# EAGLE design 011_02 (EAGLE 4.11)
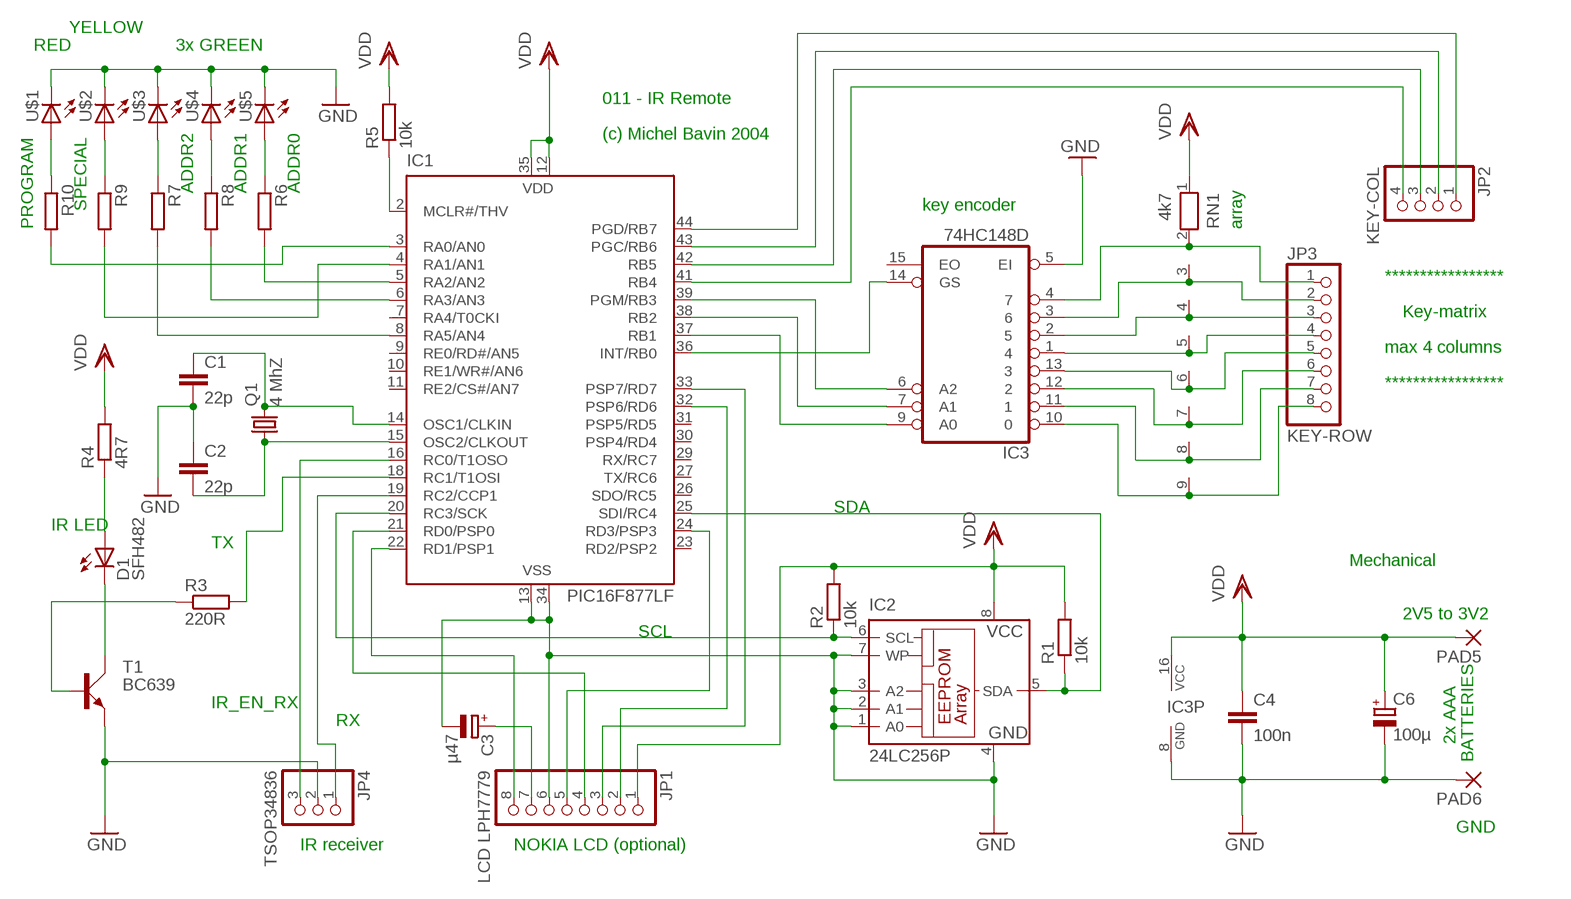
[diagram p0: schematic, sheet 1]

## Parts
C1  22p  C-EU025-024X044  [C025-024X044]
C2  22p  C-EU025-024X044  [C025-024X044]
C3  µ47  CPOL-EUE2.5-5  [E2,5-5]
C4  100n  C-EU025-024X044  [C025-024X044]
C6  100µ  CPOL-EUE2-5  [E2-5]
D1  SFH482  [SFH482]
IC1  PIC16F877LF  [S44]
IC2  24LC256P  [DIL8]
IC3  74HC148D  [SO16]
JP1  LCD LPH7779  PINHD-1X8  [1X08]
JP2  KEY-COL  PINHD-1X4  [1X04]
JP3  KEY-ROW  PINHD-1X8  [1X08]
JP4  TSOP34836  PINHD-1X3  [1X03]
PAD5  1,6/0,8  [1,6/0,8]
PAD6  1,6/0,8  [1,6/0,8]
Q1  4 MhZ  CRYTALHC49S  [HC49/S]
R1  10k  R-EU_0309/V  [0309V]
R2  10k  R-EU_0309/V  [0309V]
R3  220R  R-EU_0309/V  [0309V]
R4  4R7  R-EU_0309/V  [0309V]
R5  10k  R-EU_0309/V  [0309V]
R6  R-EU_0309/V  [0309V]
R7  R-EU_0309/V  [0309V]
R8  R-EU_0309/V  [0309V]
R9  R-EU_0309/V  [0309V]
R10  R-EU_0309/V  [0309V]
RN1  4k7  RN08  [RN-9]
T1  BC639  [SOT54D]
U$1  LED3MM  [LED3MM]
U$2  LED3MM  [LED3MM]
U$3  LED3MM  [LED3MM]
U$4  LED3MM  [LED3MM]
U$5  LED3MM  [LED3MM]

## Nets
GND: C1.2 C2.1 C3.- C4.2 C6.- IC1.13(VSS) IC1.34(VSS) IC2.1(A0) IC2.2(A1) IC2.3(A2) IC2.4(GND) IC2.7(WP) IC3.5(EI) IC3.8(GND) JP1.6 JP4.2 PAD6.1(P) T1.E U$1.K(C) U$2.K(C) U$3.K(C) U$4.K(C) U$5.K(C)
N$1: IC1.36(INT/RB0) IC3.14(GS)
N$2: IC1.39(PGM/RB3) IC3.6(A2)
N$3: IC1.38(RB2) IC3.7(A1)
N$4: IC1.37(RB1) IC3.9(A0)
N$5: IC3.4 JP3.1 RN1.2
N$6: IC3.2 JP3.3 RN1.4
N$7: IC3.12 JP3.6 RN1.7
N$8: IC3.3 JP3.2 RN1.3
N$9: IC3.13 JP3.5 RN1.6
N$10: IC1.20(RC3/SCK) IC2.6(SCL) R2.1
N$11: IC3.11 JP3.7 RN1.8
N$12: IC3.10 JP3.8 RN1.9
N$13: C2.2 IC1.15(OSC2/CLKOUT) Q1.1
N$14: C1.1 IC1.14(OSC1/CLKIN) Q1.2
N$15: IC3.1 JP3.4 RN1.5
N$16: IC1.25(SDI/RC4) IC2.5(SDA) R1.1
N$17: IC1.2(MCLR#/THV) R5.1
N$18: IC1.41(RB4) JP2.4
N$19: IC1.42(RB5) JP2.3
N$20: IC1.43(PGC/RB6) JP2.2
N$21: IC1.44(PGD/RB7) JP2.1
N$22: IC1.18(RC1/T1OSI) R3.2
N$23: R3.1 T1.B
N$24: D1.K(C) T1.C
N$25: D1.A R4.1
N$26: IC1.16(RC0/T1OSO) JP4.3
N$27: IC1.19(RC2/CCP1) JP4.1
N$28: IC1.21(RD0/PSP0) JP1.4
N$29: IC1.22(RD1/PSP1) JP1.8
N$30: IC1.24(RD3/PSP3) JP1.5
N$31: IC1.32(PSP6/RD6) JP1.2
N$32: IC1.33(PSP7/RD7) JP1.3
N$33: C3.+ JP1.7
N$34: IC1.8(RA5/AN4) R7.2
N$35: IC1.6(RA3/AN3) R8.2
N$36: IC1.5(RA2/AN2) R6.2
N$37: IC1.4(RA1/AN1) R9.2
N$38: IC1.3(RA0/AN0) R10.2
N$39: R10.1 U$1.A
N$40: R9.1 U$2.A
N$41: R7.1 U$3.A
N$42: R8.1 U$4.A
N$43: R6.1 U$5.A
VDD: C4.1 C6.+ IC1.12(VDD) IC1.35(VDD) IC2.8(VCC) IC3.16(VCC) JP1.1 PAD5.1(P) R1.2 R2.2 R4.2 R5.2 RN1.1
Unconnected: IC1.7(RA4/T0CKI) IC1.9(RE0/RD#/AN5) IC1.10(RE1/WR#/AN6) IC1.11(RE2/CS#/AN7) IC1.23(RD2/PSP2) IC1.26(SDO/RC5) IC1.27(TX/RC6) IC1.29(RX/RC7) IC1.30(PSP4/RD4) IC1.31(PSP5/RD5) IC3.15(EO)

## Notes on the sheet
- YELLOW
- RED | 3x GREEN
- 011 - IR Remote
- (c) Michel Bavin 2004
- ADDR2 | ADDR1 | ADDR0
- SPECIAL | key encoder
- PROGRAM | array
- *****************
- Key-matrix
- max 4 columns
- *****************
- SDA
- IR LED
- TX
- Mechanical
- 2V5 to 3V2
- SCL
- IR_EN_RX
- RX
- 2x AAA
- BATTERIES
- GND
- IR receiver | NOKIA LCD (optional)

## Library data of the parts
C1 C2 C4 = rcl:C-EU: CAPACITOR, European symbol
C3 C6 = rcl:CPOL-EU: POLARIZED CAPACITOR, European symbol
D1 = led:SFH482: IR LED infrared emitting diode, Infineon
IC1 = plcc-socket:PIC16F87*: MICROCONTROLLER
IC2 = microchip:24*: Serial EEPROM I2C
IC3 = 74xx-eu:74*148: 10-line to 4-line and 8-line to 3-line PRIORITY ENCODER
JP1 JP3 = pinhead:PINHD-1X8: PIN HEADER
JP2 = pinhead:PINHD-1X4: PIN HEADER
JP4 = pinhead:PINHD-1X3: PIN HEADER
PAD5 PAD6 = wirepad:1,6/0,8: THROUGH-HOLE PAD
Q1 = crystal:CRYTAL: CRYSTAL
R1-R10 = rcl:R-EU_: RESISTOR, European symbol
RN1 = resistor-net:RN08: RESISTOR NETWORK
T1 = transistor-small-signal:BC639: NPN TRANSISTOR
U$1-U$5 = led:LED: LED OSRAM: - CHIPLED LG R971, LG N971, LY N971, LG Q971, LY Q971, LO R971, LY R971 LH N974, LH R974 LS Q976, LO Q976, LY Q976 LO Q996 - Hyper CHIPLED LW Q18S LB Q993, LB Q99A, LB R99A - SideLED LS A670, LO A670, LY A670, LG A670, LP A670 LB A673, LV A673, LT A673, LW A673 LH A674 LY A675 LS A676, LA A676, LO A676, LY A676, LW A676 LS A679, LY A679, LG A679 - Hyper Micro SIDELED® LS Y876, LA Y876, LO Y876, LY Y876 LT Y87S - SmartLED LW L88C, LW L88S LB L89C, LB L89S, LG L890 LS L89K, LO L89K, LY L89K LS L896, LA L896, LO L896, LY L896 - TOPLED LS T670, LO T670, LY T670, LG T670, LP T670 LSG T670, LSP T670, LSY T670, LOP T670, LYG T670 LG T671, LOG T671, LSG T671 LB T673, LV T673, LT T673, LW T673 LH T674 LS T676, LA T676, LO T676, LY T676, LB T676, LH T676, LSB T676, LW T676 LB T67C, LV T67C, LT T67C, LS T67K, LO T67K, LY T67K, LW E67C LS E67B, LA E67B, LO E67B, LY E67B, LB E67C, LV E67C, LT E67C LW T67C LS T679, LY T679, LG T679 LS T770, LO T770, LY T770, LG T770, LP T770 LB T773, LV T773, LT T773, LW T773 LH T774 LS E675, LA E675, LY E675, LS T675 LS T776, LA T776, LO T776, LY T776, LB T776 LHGB T686 LT T68C, LB T68C - Hyper Mini TOPLED® LB M676 - Mini TOPLED Santana® LG M470 LS M47K, LO M47K, LY M47K Source: http://www.osram.convergy.de/

## Board
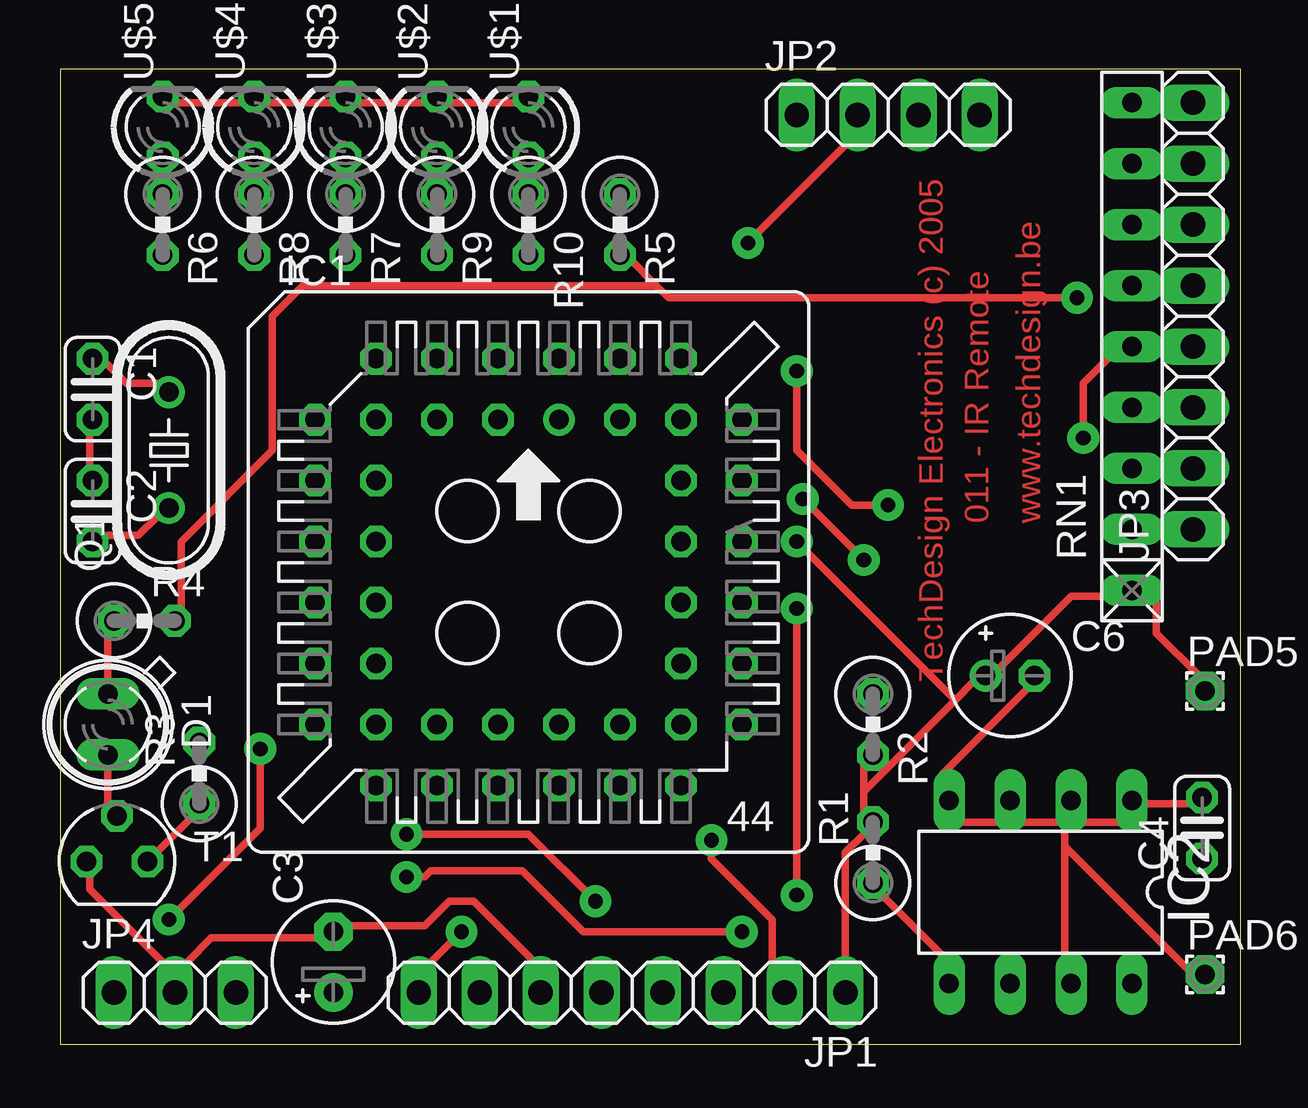
[diagram p1: board, top side]
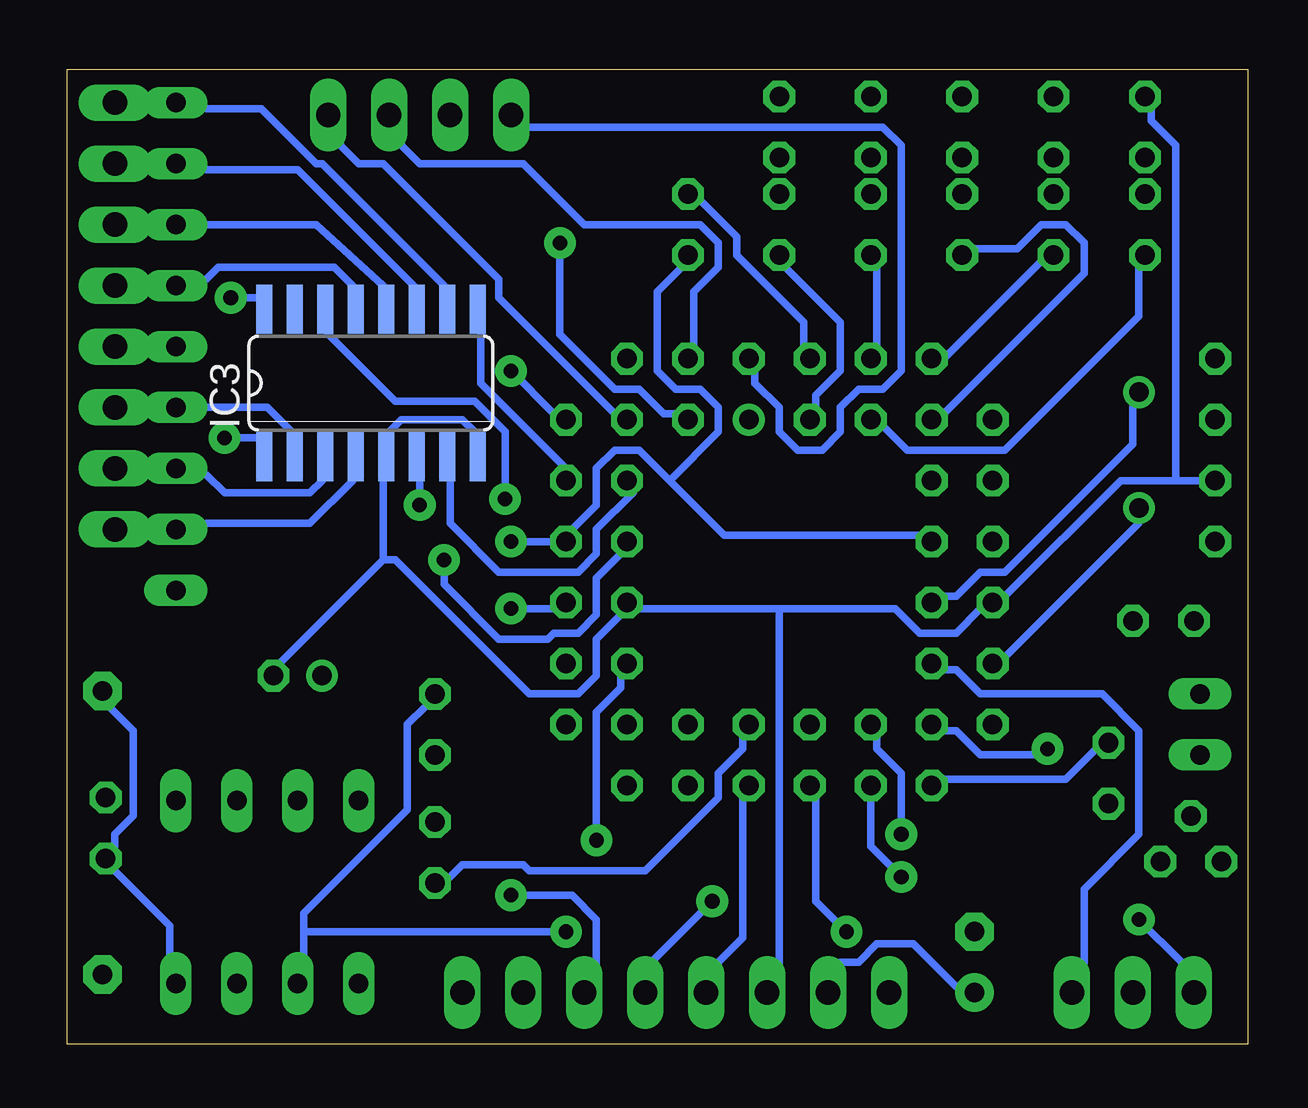
[diagram p2: board, bottom side, seen from below]

Size 49.2 x 40.63 mm. Coordinates in mm from the lower left corner, seen from the top.
Outline: 0,0 49.2,0 49.2,40.63 0,40.63 0,0
Copper layers (1*16): Top 0.035mm / dielectric 1.5mm / Bottom 0.035mm
Design rules "michel4": minimum track width 12mil, minimum drill 24mil, track to track 12mil, track to pad 12mil, pad to pad 12mil, via to via 12mil, smd to smd 10mil, copper to edge 40mil, drill to drill 8mil, minimum pad ring 10mil, minimum via ring 14mil, stop-mask expansion 4mil, vias tented up to drill 0mil, thermal gap 10mil
tRestrict: area 9.1,9.5 to 29.9,30.1; area 31.5,24.3 to 41.9,30.3

### Footprints (pad centres in the part's own frame; a part is rotated, then mirrored left to right if it is on the bottom)
C025-024X044 = drill 0.813 octagon: 1 -1.27,0; 2 1.27,0
E2,5-5 = drill 0.813 pad 1.6 round: + -1.27,0 | drill 0.813 pad 1.6 octagon: - 1.27,0
E2-5 = drill 0.813 pad 1.27 round: + -1.016,0 | drill 0.813 pad 1.27 octagon: - 1.016,0
SFH482 = drill 0.813 long: A -1.27,0; K 1.27,0
S44 = drill 0.813 round: 1 1.27,6.35 | drill 0.813 octagon: 2 -1.27,8.89; 3 -1.27,6.35; 4 -3.81,8.89; 5 -3.81,6.35; 6 -6.35,8.89; 7 -8.89,6.35; 8 -6.35,6.35; 9 -8.89,3.81; 10 -6.35,3.81; 11 -8.89,1.27; 12 -6.35,1.27; 13 -8.89,-1.27; 14 -6.35,-1.27; 15 -8.89,-3.81; 16 -6.35,-3.81; 17 -8.89,-6.35; 18 -6.35,-8.89; 19 -6.35,-6.35; 20 -3.81,-8.89; 21 -3.81,-6.35; 22 -1.27,-8.89; 23 -1.27,-6.35; 24 1.27,-8.89; 25 1.27,-6.35; 26 3.81,-8.89; 27 3.81,-6.35; 28 6.35,-8.89; 29 8.89,-6.35; 30 6.35,-6.35; 31 8.89,-3.81; 32 6.35,-3.81; 33 8.89,-1.27; 34 6.35,-1.27; 35 8.89,1.27; 36 6.35,1.27; 37 8.89,3.81; 38 6.35,3.81; 39 8.89,6.35; 40 6.35,8.89; 41 6.35,6.35; 42 3.81,8.89; 43 3.81,6.35; 44 1.27,8.89
DIL8 = drill 0.813 long: 1 -3.81,-3.81; 2 -1.27,-3.81; 3 1.27,-3.81; 4 3.81,-3.81; 5 3.81,3.81; 6 1.27,3.81; 7 -1.27,3.81; 8 -3.81,3.81
SO16 = smd 0.66 x 2.032: 1 -4.445,-3.073; 2 -3.175,-3.073; 3 -1.905,-3.073; 4 -0.635,-3.073; 5 0.635,-3.073; 6 1.905,-3.073; 7 3.175,-3.073; 8 4.445,-3.073; 9 4.445,3.073; 10 3.175,3.073; 11 1.905,3.073; 12 0.635,3.073; 13 -0.635,3.073; 14 -1.905,3.073; 15 -3.175,3.073; 16 -4.445,3.073
1X08 = drill 1.016 long: 1 -8.89,0; 2 -6.35,0; 3 -3.81,0; 4 -1.27,0; 5 1.27,0; 6 3.81,0; 7 6.35,0; 8 8.89,0
1X04 = drill 1.016 long: 1 -3.81,0; 2 -1.27,0; 3 1.27,0; 4 3.81,0
1X03 = drill 1.016 long: 1 -2.54,0; 2 0,0; 3 2.54,0
1,6/0,8 = drill 0.813 pad 1.6 octagon: 1 0,0
HC49/S = drill 0.813 round: 1 -2.413,0; 2 2.413,0
0309V = drill 0.813 octagon: 1 -1.27,0; 2 1.27,0
RN-9 = drill 0.813 long: 1 -10.16,0; 2 -7.62,0; 3 -5.08,0; 4 -2.54,0; 5 0,0; 6 2.54,0; 7 5.08,0; 8 7.62,0; 9 10.16,0
SOT54D = drill 0.813 octagon: B 1.27,0; C 0,1.905; E -1.27,0
LED3MM = drill 0.813 octagon: A -1.27,0; K 1.27,0

### Placement (x,y rotation side)
C1  1.36,27.3 270 top
C2  1.36,22.22 270 top
C3  11.39,3.42 90 top
C4  47.59,9.01 90 top
C6  39.59,15.36 0 top
D1  1.99,13.33 270 top
IC1  19.52,19.68 0 top
IC2  40.86,6.34 180 top
IC3  36.54,27.55 0 bottom
JP1  23.84,2.15 180 top
JP2  34.51,38.73 0 top
JP3  47.21,30.35 90 top
JP4  4.79,2.15 0 top
PAD5  47.71,14.73 0 top
PAD6  47.71,2.92 0 top
Q1  4.53,24.76 90 top
R1  33.87,8 90 top
R2  33.87,13.33 270 top
R3  5.8,11.3 90 top
R4  3.52,17.65 0 top
R5  23.33,34.16 270 top
R6  4.28,34.16 270 top
R7  11.9,34.16 270 top
R8  8.09,34.16 270 top
R9  15.71,34.16 270 top
R10  19.52,34.16 270 top
RN1  44.67,29.08 90 top
T1  2.38,7.61 0 top
U$1  19.52,38.22 90 top
U$2  15.71,38.22 90 top
U$3  11.9,38.22 90 top
U$4  8.09,38.22 90 top
U$5  4.28,38.22 90 top

### Tracks (layer width: path | path; a pad name or v marks a point on that pad's centre or on a via)
GND
  Top 0.305: 41.87,8.25 41.87,9.01 IC2.2 | 41.87,8.25 41.87,3.68 IC2.7 | IC2.2 42.63,9.27 44.16,9.27 IC2.1 45.17,10.03 46.95,10.03 C4.2 | 41.87,8.25 46.95,3.17 PAD6.1 | C6.- 40.35,14.85 36.79,11.3 IC2.4 37.55,9.27 39.08,9.27 IC2.3 40.09,9.27 41.62,9.27 IC2.2 | T1.E 1.23,6.98 1.23,6.47 4.28,3.42 JP4.2 5.3,3.42 6.31,4.44 10.63,4.44 C3.- 12.15,4.95 15.2,4.95 16.22,5.96 17.23,5.96 19.77,3.42 JP1.6 | U$5.K 4.79,39.24 7.58,39.24 U$4.K 8.6,39.24 11.39,39.24 U$3.K 12.41,39.24 15.2,39.24 U$2.K 16.22,39.24 19.01,39.24 U$1.K | C2.1 1.23,24 1.23,25.52 C1.2
  Bottom 0.305: IC3.8 32.22,25.27 32.22,25.52 32.73,26.03 35.27,26.03 36.03,25.27 IC3.5 36.03,23.49 36.03,20.19 | 36.03,20.19 40.35,15.87 C6.- | 3.01,23.49 5.3,23.49 10.12,18.66 IC1.13 11.14,18.16 12.15,17.14 13.68,17.14 14.69,18.16 19.52,18.16 | 3.01,23.49 C2.1 | 19.52,18.16 25.36,18.16 IC1.34 26.12,17.9 27.14,16.89 27.14,15.36 27.9,14.6 29.93,14.6 35.52,20.19 36.03,20.19 | 19.52,18.16 19.52,3.42 JP1.6 | 3.01,23.49 3.01,37.46 4.03,38.48 4.03,38.98 U$5.K
N$1  (via drill 0.61)
  Top 0.305: v33.49,20.19 v30.95,22.73
  Bottom 0.305: v30.95,22.73 30.95,25.52 32.22,26.79 35.52,26.79 38.32,29.59 38.32,29.84 IC3.14 | v33.49,20.19 33.49,19.17 31.2,16.89 29.17,16.89 28.92,17.14 27.9,17.14 27.14,17.9 27.14,19.43 26.12,20.44 IC1.36
N$2  (via drill 0.61)
  Top 0.305: v34.51,22.47 32.98,22.47 30.7,24.76 v30.7,28.06
  Bottom 0.305: v34.51,22.47 34.51,23.49 IC3.6 | v30.7,28.06 28.92,26.28 IC1.39
N$3
  Bottom 0.305: IC3.7 33.24,23.49 33.24,21.71 31.2,19.68 27.9,19.68 27.14,20.44 27.14,21.46 25.62,22.98 IC1.38
N$4
  Bottom 0.305: IC3.9 31.97,29.84 31.97,27.55 28.41,24 IC1.37
N$5
  Top 0.305: JP3.1 45.94,21.2 RN1.2
  Bottom 0.305: IC3.4 37.3,23.49 39.08,21.71 43.4,21.71 RN1.2
N$6
  Top 0.305: JP3.3 45.94,26.28 RN1.4
  Bottom 0.305: IC3.2 39.84,25.27 39.84,25.52 40.86,26.54 RN1.4
N$7
  Top 0.305: JP3.6 45.94,33.9 RN1.7
  Bottom 0.305: IC3.12 36.03,31.62 38.82,34.16 RN1.7
N$8
  Top 0.305: JP3.2 45.94,23.74 RN1.3
  Bottom 0.305: IC3.3 38.57,23.49 39.08,22.98 42.63,22.98 43.4,23.74 RN1.3
N$9
  Top 0.305: JP3.5 45.94,31.36 RN1.6
  Bottom 0.305: IC3.13 37.3,31.62 38.06,32.38 42.89,32.38 43.4,31.87 RN1.6
N$10  (via drill 0.61)
  Top 0.305: v14.44,6.98 15.2,6.98 15.46,7.23 19.27,7.23 21.81,4.69 v28.41,4.69
  Bottom 0.305: 39.33,4.69 39.33,5.46 35.01,9.77 35.01,13.33 34.25,14.09 R2.1 | 39.33,4.69 39.33,3.68 IC2.6 | v14.44,6.98 15.71,8.25 IC1.20 | v28.41,4.69 39.33,4.69
N$11
  Top 0.305: JP3.7 45.94,36.44 RN1.8
  Bottom 0.305: IC3.11 34.76,31.62 39.59,36.44 43.4,36.44 RN1.8
N$12
  Top 0.305: JP3.8 45.94,38.98 RN1.9
  Bottom 0.305: IC3.10 33.49,31.62 38.57,36.7 38.82,36.7 41.11,38.98 43.4,38.98 RN1.9
N$13
  Top 0.305: C2.2 1.99,21.2 3.26,21.2 4.03,21.97 Q1.1
  Bottom 0.305: IC1.15 10.12,16.12 4.53,21.71 Q1.1
N$14
  Top 0.305: Q1.2 4.03,27.55 2.76,27.55 1.99,28.32 C1.1
  Bottom 0.305: IC1.14 12.66,18.66 12.15,18.66 11.14,19.68 10.12,19.68 4.79,25.01 4.79,26.54 Q1.2
N$15  (via drill 0.61)
  Top 0.305: v42.63,25.27 42.63,27.55 43.65,28.57 RN1.5 45.94,28.82 JP3.4
  Bottom 0.305: v42.63,25.27 41.11,25.27 IC3.1
N$16
  Top 0.305: R1.1 34.25,6.22 36.79,3.68 IC2.5
  Bottom 0.305: IC1.25 21.04,12.82 21.04,12.31 22.06,11.3 22.06,10.28 25.11,7.23 29.93,7.23 30.19,7.49 32.73,7.49 33.24,6.98 R1.1
N$17
  Bottom 0.305: IC1.2 18.5,29.08 18.5,30.09 21.3,32.89 21.3,33.65 22.82,35.17 R5.1
N$18
  Bottom 0.305: IC1.41 26.38,26.28 31.2,31.11 31.2,31.87 36.03,36.7 37.05,36.7 37.81,37.46 JP2.4
N$19
  Bottom 0.305: IC1.42 23.08,29.08 23.08,31.36 22.06,32.38 22.06,33.4 22.82,34.16 27.65,34.16 30.19,36.7 34.51,36.7 35.27,37.46 JP2.3
N$20  (via drill 0.61)
  Top 0.305: v28.66,33.4 32.73,37.46 JP2.2
  Bottom 0.305: v28.66,33.4 28.66,29.59 26.38,27.3 25.36,27.3 24.35,26.28 23.84,26.28 IC1.43
N$21
  Bottom 0.305: IC1.44 20.54,28.06 20.54,27.55 19.52,26.54 19.52,25.52 18.76,24.76 17.74,24.76 16.98,25.52 16.98,26.54 16.22,27.3 15.2,27.3 14.44,28.06 14.44,37.46 15.2,38.22 30.19,38.22 JP2.1
N$22
  Bottom 0.305: IC1.18 12.66,11.04 7.58,11.04 6.31,12.31 R3.2
N$23
  Top 0.305: T1.B 5.55,9.52 R3.1
N$24
  Top 0.305: T1.C 1.99,10.03 D1.K
N$25
  Top 0.305: D1.A 1.99,17.14 R4.1
N$26
  Bottom 0.305: IC1.16 12.66,15.62 12.15,15.62 11.14,14.6 6.06,14.6 4.53,13.08 4.53,8.76 6.82,6.47 6.82,3.42 JP4.3
N$27  (via drill 0.61)
  Top 0.305: v8.34,12.31 8.34,9.01 v4.53,5.2
  Bottom 0.305: v8.34,12.31 8.6,12.06 11.14,12.06 12.15,13.08 12.66,13.08 IC1.19 | v4.53,5.2 2.76,3.42 JP4.1
N$28  (via drill 0.61)
  Top 0.305: v14.44,8.76 19.52,8.76 v22.31,5.96
  Bottom 0.305: v14.44,8.76 14.44,11.3 15.46,12.31 15.46,12.82 IC1.21 | v22.31,5.96 24.85,3.42 JP1.4
N$29  (via drill 0.61)
  Top 0.305: v16.73,4.69 15.46,3.42 JP1.8
  Bottom 0.305: v16.73,4.69 18,5.96 18,10.28 IC1.22
N$30
  Bottom 0.305: IC1.24 21.04,10.28 21.04,4.44 22.06,3.42 JP1.5
N$31  (via drill 0.61)
  Top 0.305: v27.14,8.5 27.14,7.74 29.68,5.2 29.68,3.42 JP1.2
  Bottom 0.305: v27.14,8.5 27.14,13.84 26.12,14.85 26.12,15.36 IC1.32
N$32  (via drill 0.61)
  Top 0.305: v30.7,6.22 v30.7,18.16
  Bottom 0.305: v30.7,18.16 28.92,18.16 IC1.33 | v30.7,6.22 28.16,6.22 27.14,5.2 27.14,3.42 JP1.3
N$33
  Bottom 0.305: JP1.7 16.98,3.42 16.22,3.42 15.46,4.19 13.93,4.19 12.15,2.41 C3.+
N$34
  Bottom 0.305: R7.2 11.39,33.14 9.61,33.14 8.6,34.16 7.58,34.16 6.82,33.4 6.82,32.13 12.66,26.28 IC1.8
N$35
  Bottom 0.305: R8.2 8.6,32.63 12.66,28.57 IC1.6
N$36
  Bottom 0.305: R6.2 4.53,32.38 4.53,30.35 10.12,24.76 14.19,24.76 15.2,25.78 IC1.5
N$37
  Bottom 0.305: IC1.4 15.46,29.08 15.46,32.38 R9.2
N$38
  Bottom 0.305: IC1.3 18,26.54 18,27.05 16.98,28.06 16.98,30.09 19.27,32.38 R10.2
N$39
  Top 0.305: R10.1 19.27,35.94 19.27,36.44 U$1.A
N$40
  Top 0.305: R9.1 15.46,35.94 15.46,36.44 U$2.A
N$41
  Top 0.305: R7.1 11.65,35.94 11.65,36.44 U$3.A
N$42
  Top 0.305: R8.1 7.84,35.94 7.84,36.44 U$4.A
N$43
  Top 0.305: R6.1 4.03,35.94 4.03,36.44 U$5.A
VDD  (via drill 0.61)
  Top 0.305: PAD5.1 47.46,15.36 45.68,17.14 45.68,18.41 RN1.1 43.4,18.66 42.13,18.66 39.08,15.62 C6.+ 38.06,15.11 37.3,14.35 | 33.49,10.54 33.49,11.55 R2.2 | 33.49,10.54 33.49,9.77 R1.2 33.49,8.76 32.73,8 JP1.1 | 37.3,14.35 33.49,10.54 | v42.38,31.11 25.36,31.11 24.85,31.62 | 24.85,31.62 23.84,32.63 R5.2 | 24.85,31.62 10.12,31.62 8.85,30.35 8.85,24.76 5.04,20.95 5.04,18.16 R4.2 | v30.7,20.95 37.3,14.35
  Bottom 0.305: IC2.8 44.92,3.68 44.92,4.95 47.21,7.23 C4.1 47.21,8.25 47.21,8.76 46.44,9.52 46.44,13.08 47.46,14.09 PAD5.1 | 24.09,23.49 25.36,24.76 26.38,24.76 27.14,24 27.14,22.47 28.16,21.46 IC1.35 v30.7,20.95 | 24.09,23.49 21.81,21.2 13.68,21.2 IC1.12 | v42.38,31.11 41.11,31.11 IC3.16 | 24.09,23.49 22.06,25.52 22.06,26.54 22.82,27.3 23.84,27.3 24.6,28.06 24.6,31.36 23.58,32.38 R5.2

### Text on the board
Top: TechDesign Electronics (c) 2005 | 011 - IR Remote | www.techdesign.be